# Altium project UU006_UUDisplay.PrjPcb
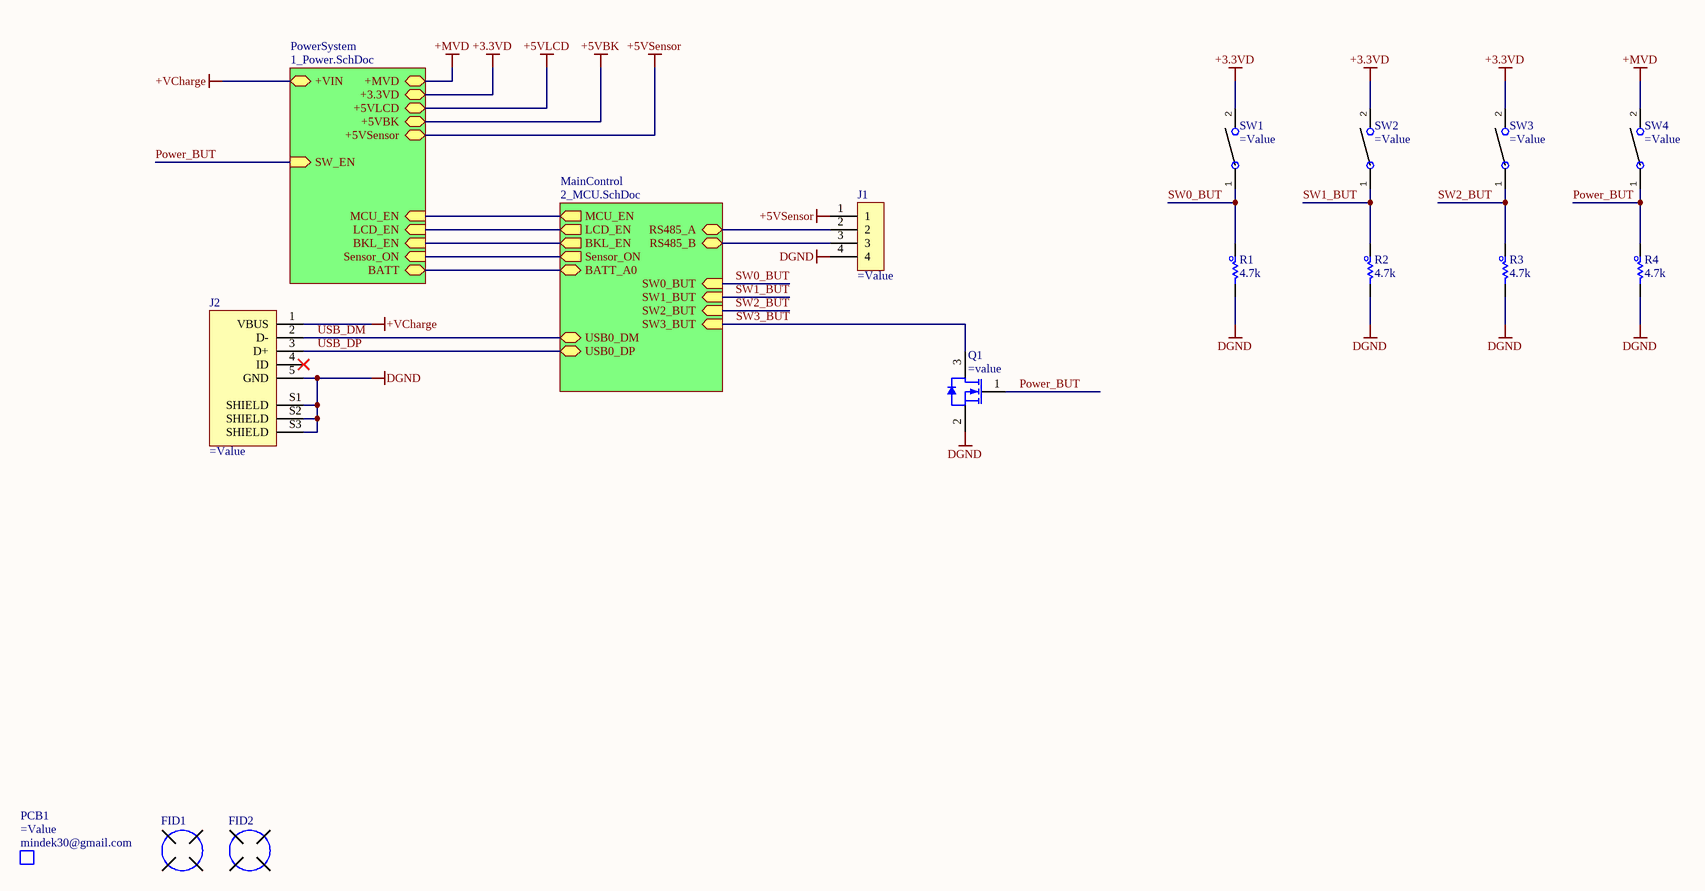
[diagram p0: 0_Overview.SchDoc]
PCB_Rev: A0; PCB_PN: UU006; PCB_Name: UUDisplay; PCBA_Rev: A0; PCBA_PN: UU006
3 sheets, 95 parts. Net scope: hierarchical (ports join the sheet entries above them; power ports are global).
Board file: UU006_UUDisplay.PcbDoc
Sheets:
  0_Overview.SchDoc
    MainControl = 2_MCU.SchDoc
    PowerSystem = 1_Power.SchDoc

## Sheet 0_Overview.SchDoc: Overview
size A3; DocumentNumber: 1; SheetNumber: 1; SheetTotal: 6; PageSetup: Record=PageOptions|CenterHorizontal=True|CenterVertical=True|PrintScale=1.01|XCorrection=1.00|YCorrection=1.00|PrintKind=0|BorderSize=5000000|LeftOffset=0|BottomOffset=0|Orientation=2|PaperLength=1000|PaperWidth=1000|Scale=100|PaperSource=7|PrintQuality=-4|MediaType=1|DitherType=10|PaperKind=A3|PrintScaleMode=1

### Parts
FID1  FIDUCIAL  [FID]  (value not drawn)  (no BOM)
FID2  FIDUCIAL  [FID]  (value not drawn)  (no BOM)
J1  (no value)  [CON_4P_Header]
J2  (no value)  [MOLEX_105133-0011]
PCB1  Manufacturer: mindek30@gmail.com  (mechanical)
Q1  (no value)  [SOT95P245X110-3M]
R1  4.7k  [R_0603]
R2  4.7k  [R_0603]
R3  4.7k  [R_0603]
R4  4.7k  [R_0603]
SW1  (no value)  [Tactile]
SW2  (no value)  [Tactile]
SW3  (no value)  [Tactile]
SW4  (no value)  [Tactile]

### Sub-sheets
MainControl = 2_MCU.SchDoc: BATT_A0 (bidir), RS485_A (bidir), RS485_B (bidir), USB0_DP (bidir), USB0_DM (bidir), MCU_EN (out), LCD_EN (out), BKL_EN (out), Sensor_ON (out), SW0_BUT (in), SW1_BUT (in), SW2_BUT (in), SW3_BUT (in)
PowerSystem = 1_Power.SchDoc: +3.3VD (bidir), +VIN (bidir), +5VLCD (bidir), +MVD (bidir), BATT (bidir), MCU_EN (in), LCD_EN (in), BKL_EN (in), +5VBK (bidir), Sensor_ON (in), +5VSensor (bidir), SW_EN (in)

### Nets
+3.3VD: SW1.2 SW2.2 SW3.2 ; sheet PowerSystem/+3.3VD
+5VSensor: J1.1 ; sheet PowerSystem/+5VSensor
+MVD: SW4.2 ; sheet PowerSystem/+MVD
+VCharge: J2.1(VBUS) ; sheet PowerSystem/+VIN
DGND: J1.4 J2.5(GND) J2.S1(SHIELD) J2.S2(SHIELD) J2.S3(SHIELD) Q1.2(S) R1.2 R2.2 R3.2 R4.2
ADC1_IN12: sheet MainControl/BATT_A0, sheet PowerSystem/BATT
Power_BUT: Q1.1(G) R4.1 SW4.1 ; sheet PowerSystem/SW_EN
PW_EN_BK: sheet MainControl/BKL_EN, sheet PowerSystem/BKL_EN
PW_EN_LCD: sheet MainControl/LCD_EN, sheet PowerSystem/LCD_EN
PW_EN_Main: sheet MainControl/MCU_EN, sheet PowerSystem/MCU_EN
PW_EN_Sensor: sheet MainControl/Sensor_ON, sheet PowerSystem/Sensor_ON
RS485_A0: J1.2 ; sheet MainControl/RS485_A
RS485_B0: J1.3 ; sheet MainControl/RS485_B
SW0_BUT: R1.1 SW1.1 ; sheet MainControl/SW0_BUT
SW1_BUT: R2.1 SW2.1 ; sheet MainControl/SW1_BUT
SW2_BUT: R3.1 SW3.1 ; sheet MainControl/SW2_BUT
SW3_BUT: Q1.3(D) ; sheet MainControl/SW3_BUT
USB_DM: J2.2(D-) ; sheet MainControl/USB0_DM
USB_DP: J2.3(D+) ; sheet MainControl/USB0_DP

Not connected (* = marked no-connect by the designer): J2 4(ID)*

### Notes on the sheet
- Title :
- Revision :
- ผู้จัดทำ:
- Size:
- A3
- Time:
- ผู้เขียน:
- บริษัท ยูนิเวอร์แซล ยูทีลิตี้ส์ จำกัด (มหาชน) เลขที่ 1 อาคาร อีสท์วอเตอร์ ชั้น 18 ซอยวิภาวดีรังสิต 5 แขวงจอมพล เขตจตุจักร กรุงเทพฯ 10900
  Tel : +662-272-1688
  Fax :+662-2721690-1
- -
- Sheet:
- of
- ผู้อำนวยการ
- ผู้ตรวจสอบ:
- Number:
- กรรมการผู้จัดการ:
- File:

### Library data of the parts
FID1 FID2 = FID_FIDUCIAL: Manufacturer: mindek30@gmail.com; PartNumber: UU006_A0; Value2: Non SE; Value: Non SE; PartID: A0; PackageReference: Non SE; Value3: Non SE
J1 = CON_4P_Heder: Connector 4 position; PartNumber: *; PartID: *; Manufacturer: *; PackageReference: *; Value: *; Value2: *; Value3: *
J2 = CON_USBMiniB_TH: USB 2.0 1 Brick nogging 5 Female Micro-B SMD USB Connectors ROHS; PartNumber: 1051330011; Manufacturer: Molex; Value: 1051330011; PartID: C586226; PackageReference: *; Value2: *; Value3: *
PCB1 = PCB_Bare: BARE PCB; PartNumber: UU006_A0; PackageReference: Non SE; PartID: A0; Value2: =JobFile_Title; Value: =PartNumber; Value3: UU006_A0
Q1 = Q_NMOS_RK7002BMT116: MOSFET N-Channel 60V/250mA,0.2W; Manufacturer: ROHM; Value: RK7002BMT116; PackageReference: SOT23; PartID: 0176-0358-6; PartNumber: RK7002BMT116; Value3: *
R1-R4 = R_Resister: RES 4.7K OHM 5% 1/10W 0603; Manufacturer: Vishay Dale; PartNumber: CRCW06034K70JNEBC; Value2: 0.1W; Value: 4.7k; PackageReference: 0603; PartID: 541-CRCW06034K70JNEBCCT-ND; Value3: *
SW1-SW4 = SW_TAC_TH: SWITCH TACTILE SPST-NO 0.05A 50V; PartNumber: TC-0308-X-ROHS; Manufacturer: WEALTH METAL; Value: TC-0308-X-ROHS; PartID: 0171-0064-8; PackageReference: *; Value2: *; Value3: *

## Sheet 2_MCU.SchDoc
size A3; DocumentNumber: 3; SheetNumber: 3; SheetTotal: 6; PageSetup: Record=PageOptions|CenterHorizontal=True|CenterVertical=True|PrintScale=1.01|XCorrection=1.00|YCorrection=1.00|PrintKind=0|BorderSize=5000000|LeftOffset=0|BottomOffset=0|Orientation=2|PaperLength=1000|PaperWidth=1000|Scale=100|PaperSource=7|PrintQuality=-4|MediaType=1|DitherType=10|PaperKind=A3|PrintScaleMode=1
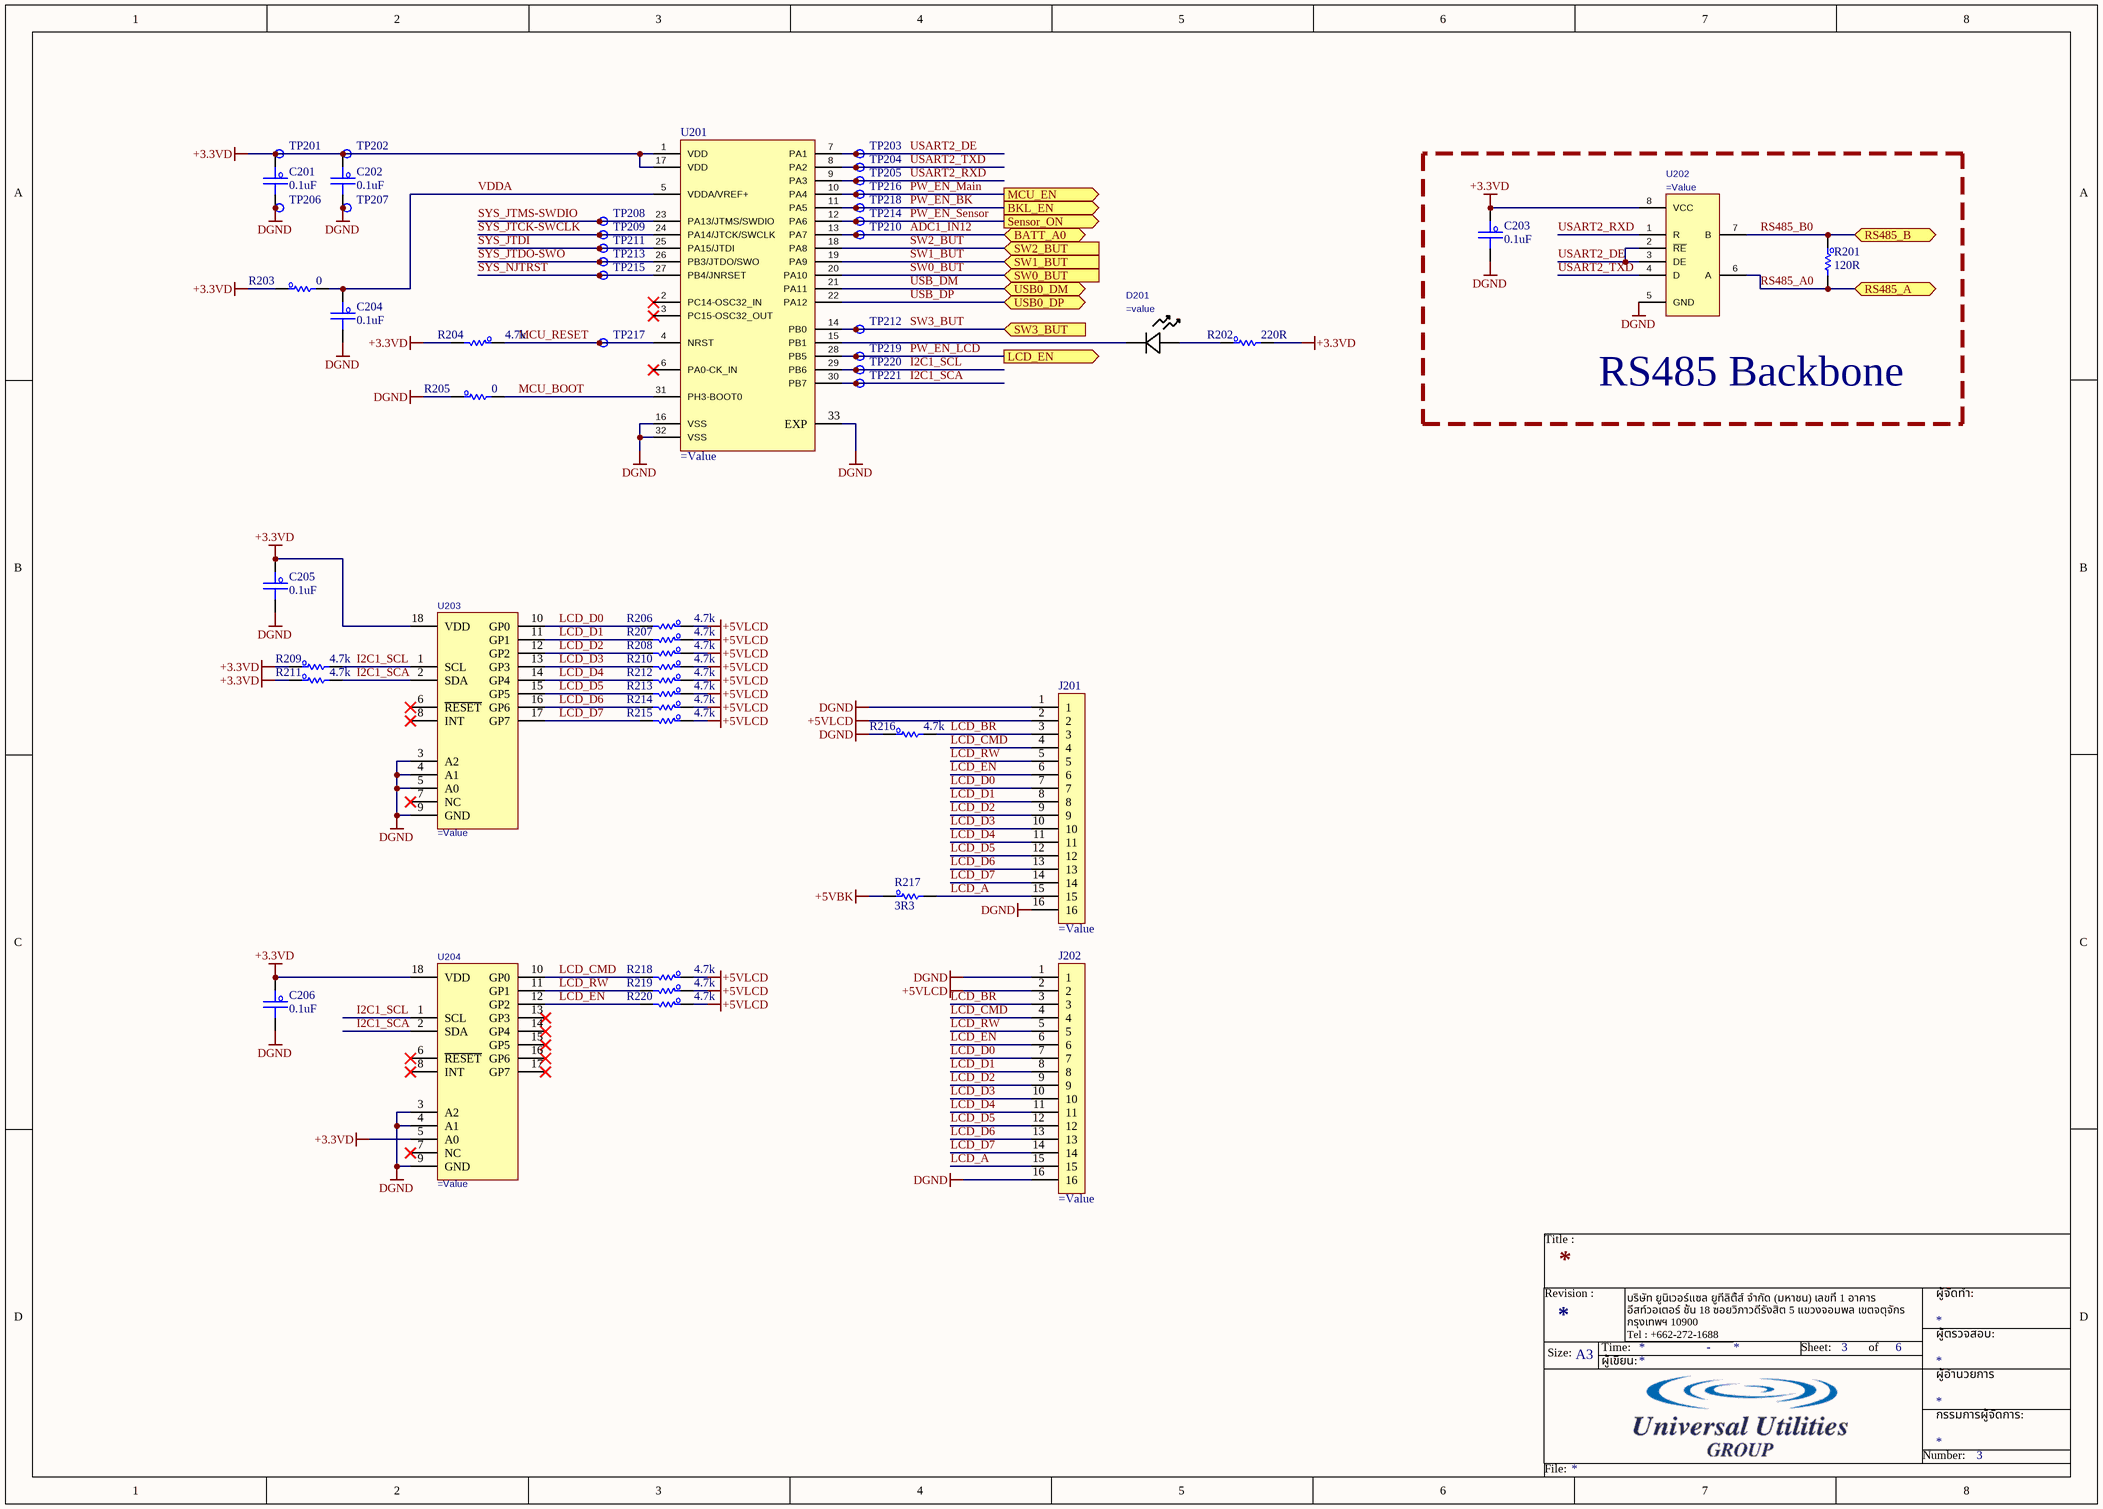
[diagram p1: 2_MCU.SchDoc]

### Parts
C201  0.1uF  [C_0603]
C202  0.1uF  [C_0603]
C203  0.1uF  [C_0603]
C204  0.1uF  [C_0603]
C205  0.1uF  [C_0603]
C206  0.1uF  [C_0603]
D201  (no value)  [LED_0VS75000_WRE]
J201  (no value)  [CON_16P_Header]
J202  (no value)  [CON_16P_Header]
R201  120R  [R_0603]
R202  220R  [R_0603]
R203  0  [R_0603]
R204  4.7k  [R_0603]
R205  0  [R_0603]
R206  4.7k  [R_0603]
R207  4.7k  [R_0603]
R208  4.7k  [R_0603]
R209  4.7k  [R_0603]
R210  4.7k  [R_0603]
R211  4.7k  [R_0603]
R212  4.7k  [R_0603]
R213  4.7k  [R_0603]
R214  4.7k  [R_0603]
R215  4.7k  [R_0603]
R216  4.7k  [R_0603]
R217  3R3  [R_2512]
R218  4.7k  [R_0603]
R219  4.7k  [R_0603]
R220  4.7k  [R_0603]
TP201  (no value)  [TP_Testpoint]  (no BOM)
TP202  (no value)  [TP_Testpoint]  (no BOM)
TP203  (no value)  [TP_Testpoint]  (no BOM)
TP204  (no value)  [TP_Testpoint]  (no BOM)
TP205  (no value)  [TP_Testpoint]  (no BOM)
TP206  (no value)  [TP_Testpoint]  (no BOM)
TP207  (no value)  [TP_Testpoint]  (no BOM)
TP208  (no value)  [TP_Testpoint]  (no BOM)
TP209  (no value)  [TP_Testpoint]  (no BOM)
TP210  (no value)  [TP_Testpoint]  (no BOM)
TP211  (no value)  [TP_Testpoint]  (no BOM)
TP212  (no value)  [TP_Testpoint]  (no BOM)
TP213  (no value)  [TP_Testpoint]  (no BOM)
TP214  (no value)  [TP_Testpoint]  (no BOM)
TP215  (no value)  [TP_Testpoint]  (no BOM)
TP216  (no value)  [TP_Testpoint]  (no BOM)
TP217  (no value)  [TP_Testpoint]  (no BOM)
TP218  (no value)  [TP_Testpoint]  (no BOM)
TP219  (no value)  [TP_Testpoint]  (no BOM)
TP220  (no value)  [TP_Testpoint]  (no BOM)
TP221  (no value)  [TP_Testpoint]  (no BOM)
U201  (no value)  [QFN50P500X500X60-33N]
U202  (no value)  [D0008A_L]
U203  (no value)  [SOIC127P1030X265-18N]
U204  (no value)  [SOIC127P1030X265-18N]

### Blocks framed on the sheet
RS485 Backbone: C203 R201 U202

### Ports
BATT_A0 (bidir), BKL_EN (out), LCD_EN (out), MCU_EN (out), RS485_A (bidir), RS485_B (bidir), Sensor_ON (out), SW0_BUT (in), SW1_BUT (in), SW2_BUT (in), SW3_BUT (in), USB0_DM (bidir), USB0_DP (bidir)

### Nets
+3.3VD: C201.1 C202.1 C203.1 C205.1 C206.1 R202.2 R203.1 R204.2 R209.1 R211.1 TP201.1 TP202.1 U201.1(VDD) U201.17(VDD) U202.8(VCC) U203.18(VDD) U204.5(A0) U204.18(VDD)
+5VBK: R217.1
+5VLCD: J201.2 J202.2 R206.1 R207.1 R208.1 R210.1 R212.1 R213.1 R214.1 R215.1 R218.1 R219.1 R220.1
DGND: C201.2 C202.2 C203.2 C204.2 C205.2 C206.2 J201.1 J201.16 J202.1 J202.16 R205.1 R216.1 TP206.1 TP207.1 U201.16(VSS) U201.32(VSS) U201.33(EXP) U202.5(GND) U203.3(A2) U203.4(A1) U203.5(A0) U203.9(GND) U204.3(A2) U204.4(A1) U204.9(GND)
ADC1_IN12: TP210.1 U201.13(PA7) ; port BATT_A0
I2C1_SCA: R211.2 TP221.1 U201.30(PB7) U203.2(SDA) U204.2(SDA)
I2C1_SCL: R209.2 TP220.1 U201.29(PB6) U203.1(SCL) U204.1(SCL)
LCD_A: J201.15 J202.15 R217.2
LCD_BR: J201.3 J202.3 R216.2
LCD_CMD: J201.4 J202.4 R218.2 U204.10(GP0)
LCD_D0: J201.7 J202.7 R206.2 U203.10(GP0)
LCD_D1: J201.8 J202.8 R207.2 U203.11(GP1)
LCD_D2: J201.9 J202.9 R208.2 U203.12(GP2)
LCD_D3: J201.10 J202.10 R210.2 U203.13(GP3)
LCD_D4: J201.11 J202.11 R212.2 U203.14(GP4)
LCD_D5: J201.12 J202.12 R213.2 U203.15(GP5)
LCD_D6: J201.13 J202.13 R214.2 U203.16(GP6)
LCD_D7: J201.14 J202.14 R215.2 U203.17(GP7)
LCD_EN: J201.6 J202.6 R220.2 U204.12(GP2)
LCD_RW: J201.5 J202.5 R219.2 U204.11(GP1)
MCU_BOOT: R205.2 U201.31(PH3-BOOT0)
MCU_RESET: R204.1 TP217.1 U201.4(NRST)
PW_EN_BK: TP218.1 U201.11(PA5) ; port BKL_EN
PW_EN_LCD: TP219.1 U201.28(PB5) ; port LCD_EN
PW_EN_Main: TP216.1 U201.10(PA4) ; port MCU_EN
PW_EN_Sensor: TP214.1 U201.12(PA6) ; port Sensor_ON
RS485_A0: R201.2 U202.6(A) ; port RS485_A
RS485_B0: R201.1 U202.7(B) ; port RS485_B
SW0_BUT: U201.20(PA10) ; port SW0_BUT
SW1_BUT: U201.19(PA9) ; port SW1_BUT
SW2_BUT: U201.18(PA8) ; port SW2_BUT
SW3_BUT: TP212.1 U201.14(PB0) ; port SW3_BUT
SYS_JTCK-SWCLK: TP209.1 U201.24(PA14/JTCK/SWCLK)
SYS_JTDI: TP211.1 U201.25(PA15/JTDI)
SYS_JTDO-SWO: TP213.1 U201.26(PB3/JTDO/SWO)
SYS_JTMS-SWDIO: TP208.1 U201.23(PA13/JTMS/SWDIO)
SYS_NJTRST: TP215.1 U201.27(PB4/JNRSET)
USART2_DE: TP203.1 U201.7(PA1) U202.2(~{RE}) U202.3(DE)
USART2_RXD: TP205.1 U201.9(PA3) U202.1(R)
USART2_TXD: TP204.1 U201.8(PA2) U202.4(D)
USB_DM: U201.21(PA11) ; port USB0_DM
USB_DP: U201.22(PA12) ; port USB0_DP
VDDA: C204.1 R203.2 U201.5(VDDA/VREF+)
NetD201_1: D201.1 R202.1
NetD201_2: D201.2 U201.15(PB1)

Not connected (* = marked no-connect by the designer): U201 2(PC14-OSC32_IN)* 3(PC15-OSC32_OUT)* 6(PA0-CK_IN)*; U203 6(~{RESET})* 7(NC)* 8(INT)*; U204 6(~{RESET})* 7(NC)* 8(INT)* 13(GP3)* 14(GP4)* 15(GP5)* 16(GP6)* 17(GP7)*

### Notes on the sheet
- Title :
- Revision :
- ผู้จัดทำ:
- Size:
- A3
- Time:
- ผู้เขียน:
- บริษัท ยูนิเวอร์แซล ยูทีลิตี้ส์ จำกัด (มหาชน) เลขที่ 1 อาคาร อีสท์วอเตอร์ ชั้น 18 ซอยวิภาวดีรังสิต 5 แขวงจอมพล เขตจตุจักร กรุงเทพฯ 10900
  Tel : +662-272-1688
  Fax :+662-2721690-1
- -
- Sheet:
- of
- ผู้อำนวยการ
- ผู้ตรวจสอบ:
- Number:
- กรรมการผู้จัดการ:
- File:

### Library data of the parts
C201-C206 = C_Capacitor: CAP CER 0.1UF 50V X7R 0603; Manufacturer: KEMET; PartNumber: C0603C104K5RACTU; PackageReference: 0603; PartID: 399-5089-1-ND; Value2: 50V; Value: 0.1uF; Value3: *
D201 = D_LED_150060BS75000: LED BLUE CLEAR 0603 SMD; Manufacturer: Wurth Electronics; Value: 150060VS75000; PackageReference: 0603; PartID: 732-4980-1-ND; PartNumber: 150060VS75000
J201 J202 = CON_16P_Heder: Connector 6 position; PartNumber: *; PartID: *; Manufacturer: *; PackageReference: *; Value: *; Value2: *; Value3: *
R201 = R_Resister: RES SMD 120 OHM 1% 1/3W 0603; Manufacturer: Vishay Dale; PartNumber: CRCW0603120RFKEAHP; Value2: 0.333W; Value: 120R; PackageReference: 0603; PartID: 541-120SCT-ND; Value3: *
R202 = R_Resister: RES SMD 220 OHM 1% 1/10W 0603; Manufacturer: Vishay Dale; PartNumber: CRCW0603220RFKEAC; Value2: 0.1W; Value: 220R; PackageReference: 0603; PartID: 541-4047-1-ND; Value3: *
R203 R205 = R_Resister: RES SMD 0 OHM JUMP 1/10W 0603; Manufacturer: Vishay Dale; PartNumber: CRCW06030000Z0EBC; Value2: 0.1W; Value: 0; PackageReference: 0603; PartID: 541-4013-1-ND; Value3: *
R204 R206-R216 R218-R220 = R_Resister: as R1 on sheet 0_Overview; Value: 4.7k; PackageReference: 0603; PartID: 541-CRCW06034K70JNEBCCT-ND; Value3: *
R217 = R_Resister: RES SMD 3.3 OHM 5% 3W 2512; Manufacturer: Vishay; PartNumber: 35223R3JT; Value: 3R3; PackageReference: 2512; PartID: A121247CT-ND; Value2: 3W; Value3: 5%
TP201-TP221 = TP_TestPoint: TestPoint; Manufacturer: *; PackageReference: *; PartID: *; PartNumber: *; Value2: *; Value3: *
U201 = IC_MCU_STM32L432: IC MCU 32BIT 256KB FLSH 32UFQFPN; PartNumber: STM32L432KCU6; Manufacturer: STMicroelectronics; Value: STM32L432KCU6; PartID: 497-16578-ND; PackageReference: *; Value2: *; Value3: *
U202 = IC_TRAN_THVD1505DR: IC TRANSCEIVER HALF 1/1 8SOIC; Manufacturer: Texas Instruments; PartNumber: SN65HVD11DR; Value: SN65HVD11DR; PackageReference: 8SOIC; PartID: 0086-0766-1; Value3: SN65HVD11DR
U203 U204 = IC_INTERF_MCP23008-E/SO: IC I/O EXPANDER I2C 8B 18SOIC; Manufacturer: Microchip Technology; PartNumber: MCP23008-E/SO; Value: MCP23008-E/SO; PackageReference: 18-SOIC; PartID: 0035-0598-4

## Sheet 1_Power.SchDoc
size A3; DocumentNumber: 2; SheetNumber: 2; SheetTotal: 6
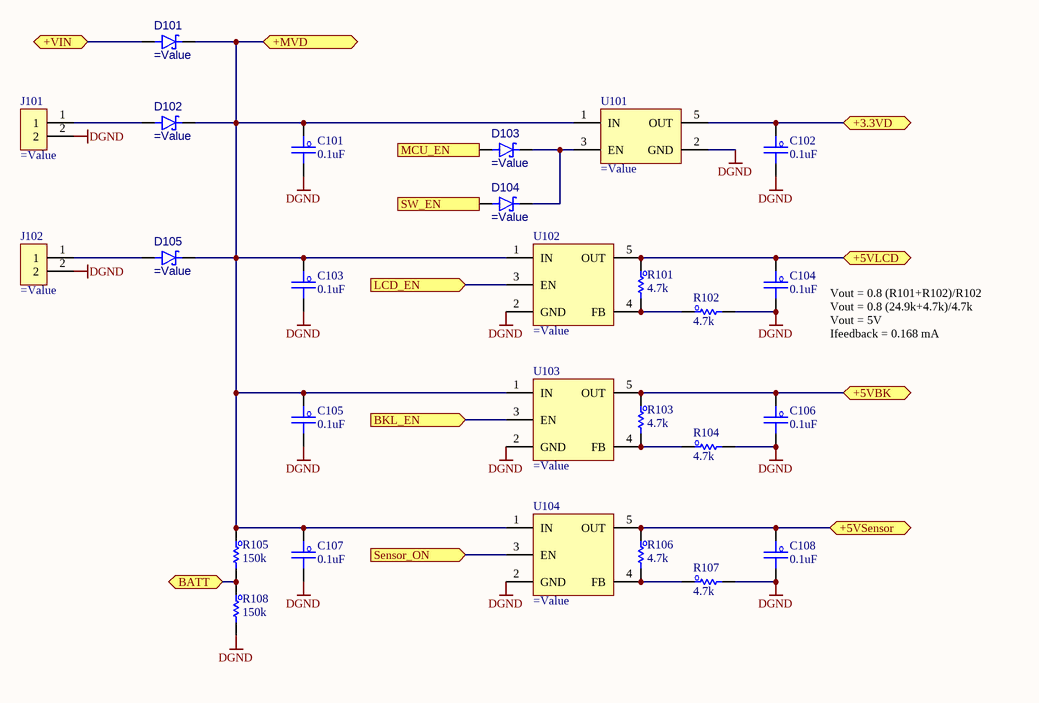
[diagram p2: 1_Power.SchDoc]

### Parts
C101  0.1uF  [C_0603]
C102  0.1uF  [C_0603]
C103  0.1uF  [C_0603]
C104  0.1uF  [C_0603]
C105  0.1uF  [C_0603]
C106  0.1uF  [C_0603]
C107  0.1uF  [C_0603]
C108  0.1uF  [C_0603]
D101  (no value)  [DIOM4325X250N]
D102  (no value)  [DIOM4325X250N]
D103  (no value)  [DIOM4325X250N]
D104  (no value)  [DIOM4325X250N]
D105  (no value)  [DIOM4325X250N]
J101  (no value)  [CON_2P_Header]
J102  (no value)  [CON_2P_Header]
R101  4.7k  [R_0603]
R102  4.7k  [R_0603]
R103  4.7k  [R_0603]
R104  4.7k  [R_0603]
R105  150k  [R_0603]
R106  4.7k  [R_0603]
R107  4.7k  [R_0603]
R108  150k  [R_0603]
U101  (no value)  [SOT95P280X125-5N]
U102  (no value)  [SOT95P280X145-5N]
U103  (no value)  [SOT95P280X145-5N]
U104  (no value)  [SOT95P280X145-5N]

### Ports
+3.3VD (bidir), +5VBK (bidir), +5VLCD (bidir), +5VSensor (bidir), +MVD (bidir), +VIN (bidir), BATT (bidir), BKL_EN (in), LCD_EN (in), MCU_EN (in), Sensor_ON (in), SW_EN (in)

### Nets
+3.3VD: C102.1 U101.5(OUT) ; port +3.3VD
+5VBK: C106.1 R103.1 U103.5(OUT) ; port +5VBK
+5VLCD: C104.1 R101.1 U102.5(OUT) ; port +5VLCD
+5VSensor: C108.1 R106.1 U104.5(OUT) ; port +5VSensor
+MVD: C101.1 C103.1 C105.1 C107.1 D101.1 D102.1 D105.1 R105.1 U101.1(IN) U102.1(IN) U103.1(IN) U104.1(IN) ; port +MVD
+VCharge: D101.2 ; port +VIN
DGND: C101.2 C102.2 C103.2 C104.2 C105.2 C106.2 C107.2 C108.2 J101.2 J102.2 R102.2 R104.2 R107.2 R108.2 U101.2(GND) U102.2(GND) U103.2(GND) U104.2(GND)
ADC1_IN12: R105.2 R108.1 ; port BATT
Power_BUT: D104.2 ; port SW_EN
PW_EN_BK: U103.3(EN) ; port BKL_EN
PW_EN_LCD: U102.3(EN) ; port LCD_EN
PW_EN_Main: D103.2 ; port MCU_EN
PW_EN_Sensor: U104.3(EN) ; port Sensor_ON
NetD102_2: D102.2 J101.1
NetD103_1: D103.1 D104.1 U101.3(EN)
NetD105_2: D105.2 J102.1
NetR101_2: R101.2 R102.1 U102.4(FB)
NetR103_2: R103.2 R104.1 U103.4(FB)
NetR106_2: R106.2 R107.1 U104.4(FB)

### Notes on the sheet
- Vout = 0.8 (R101+R102)/R102
  Vout = 0.8 (24.9k+4.7k)/4.7k
  Vout = 5V
  Ifeedback = 0.168 mA
- Title :
- Revision :
- ผู้จัดทำ:
- Size:
- A3
- Time:
- ผู้เขียน:
- บริษัท ยูนิเวอร์แซล ยูทีลิตี้ส์ จำกัด (มหาชน) เลขที่ 1 อาคาร อีสท์วอเตอร์ ชั้น 18 ซอยวิภาวดีรังสิต 5 แขวงจอมพล เขตจตุจักร กรุงเทพฯ 10900
  Tel : +662-272-1688
  Fax :+662-2721690-1
- -
- Sheet:
- of
- ผู้อำนวยการ
- ผู้ตรวจสอบ:
- Number:
- กรรมการผู้จัดการ:
- File:

### Library data of the parts
C101-C108 = C_Capacitor: as C201 on sheet 2_MCU; PackageReference: 0603; PartID: 399-5089-1-ND; Value2: 50V; Value: 0.1uF; Value3: *
D101-D105 = D_PW_SK310A: DIODE SCHOTTKY 100V 3A DO214AC; Manufacturer: Taiwan Semiconductor Corporation; Value: SK310A R2; PartID: 0029-0147-1; PartNumber: SK310A R2
J101 J102 = CON_2P_Heder: Connector 2 position; PartNumber: 796866-2; Manufacturer: TE Connectivity AMP Connectors; Value: 796866-2; PartID: A98302-ND; PackageReference: TERM BLOCK; Value3: *
R101-R104 R106 R107 = R_Resister: as R1 on sheet 0_Overview; Value: 4.7k; PackageReference: 0603; PartID: 541-CRCW06034K70JNEBCCT-ND; Value3: *
R105 R108 = R_Resister: RES SMD 150K OHM 1% 1/10W 0603; Manufacturer: Vishay Dale; PartNumber: CRCW0603150KFKEAC; Value2: 0.1W; Value: 150k; PackageReference: 0603; PartID: 541-4034-1-ND; Value3: *
U101 = IC_LDO_BU33SD5WG-TR: IC REG LINEAR 3.3V 500MA 5SSOP; Manufacturer: Rohm Semiconductor; PartNumber: BU33SD5WG-TR; PartID: 0176-0571-3; PackageReference: SOT-753; Value: BU33SD5WG-TR; Value2: *; Value3: *
U102-U104 = IC_LDO_ZTP7001: 70dB@(1kHz) 600mA 65μA 420mV@600mA -40℃~+125℃@(Tj) Adjustable Positive 70uVrms 1 6V Overcurrent Protection，Enable, Thermal Protection SOT-23-5L Linear Voltage Regulators (LDO) ROHS; PartNumber: ZTP7001-00; Manufacturer: ZILLTEK; Value: ZTP7001-00; PartID: C481271; PackageReference: SOT-23-5; Value2: *; Value3: *

## Nets that join several sheets
+3.3VD: 0_Overview (SW1.2 SW2.2 SW3.2), 2_MCU (18 pins), 1_Power (C102.1 U101.5)
+5VBK: 2_MCU (R217.1), 1_Power (C106.1 R103.1 U103.5)
+5VLCD: 2_MCU (13 pins), 1_Power (C104.1 R101.1 U102.5)
+5VSensor: 0_Overview (J1.1), 1_Power (C108.1 R106.1 U104.5)
+MVD: 0_Overview (SW4.2), 1_Power (12 pins)
+VCharge: 0_Overview (J2.1), 1_Power (D101.2)
DGND: 0_Overview (10 pins), 2_MCU (25 pins), 1_Power (18 pins)
ADC1_IN12: 2_MCU (TP210.1 U201.13), 1_Power (R105.2 R108.1)
Power_BUT: 0_Overview (Q1.1 R4.1 SW4.1), 1_Power (D104.2)
PW_EN_BK: 2_MCU (TP218.1 U201.11), 1_Power (U103.3)
PW_EN_LCD: 2_MCU (TP219.1 U201.28), 1_Power (U102.3)
PW_EN_Main: 2_MCU (TP216.1 U201.10), 1_Power (D103.2)
PW_EN_Sensor: 2_MCU (TP214.1 U201.12), 1_Power (U104.3)
RS485_A0: 0_Overview (J1.2), 2_MCU (R201.2 U202.6)
RS485_B0: 0_Overview (J1.3), 2_MCU (R201.1 U202.7)
SW0_BUT: 0_Overview (R1.1 SW1.1), 2_MCU (U201.20)
SW1_BUT: 0_Overview (R2.1 SW2.1), 2_MCU (U201.19)
SW2_BUT: 0_Overview (R3.1 SW3.1), 2_MCU (U201.18)
SW3_BUT: 0_Overview (Q1.3), 2_MCU (TP212.1 U201.14)
USB_DM: 0_Overview (J2.2), 2_MCU (U201.21)
USB_DP: 0_Overview (J2.3), 2_MCU (U201.22)